# EAGLE design RY835AI_Stratux (EAGLE 8.2.1)
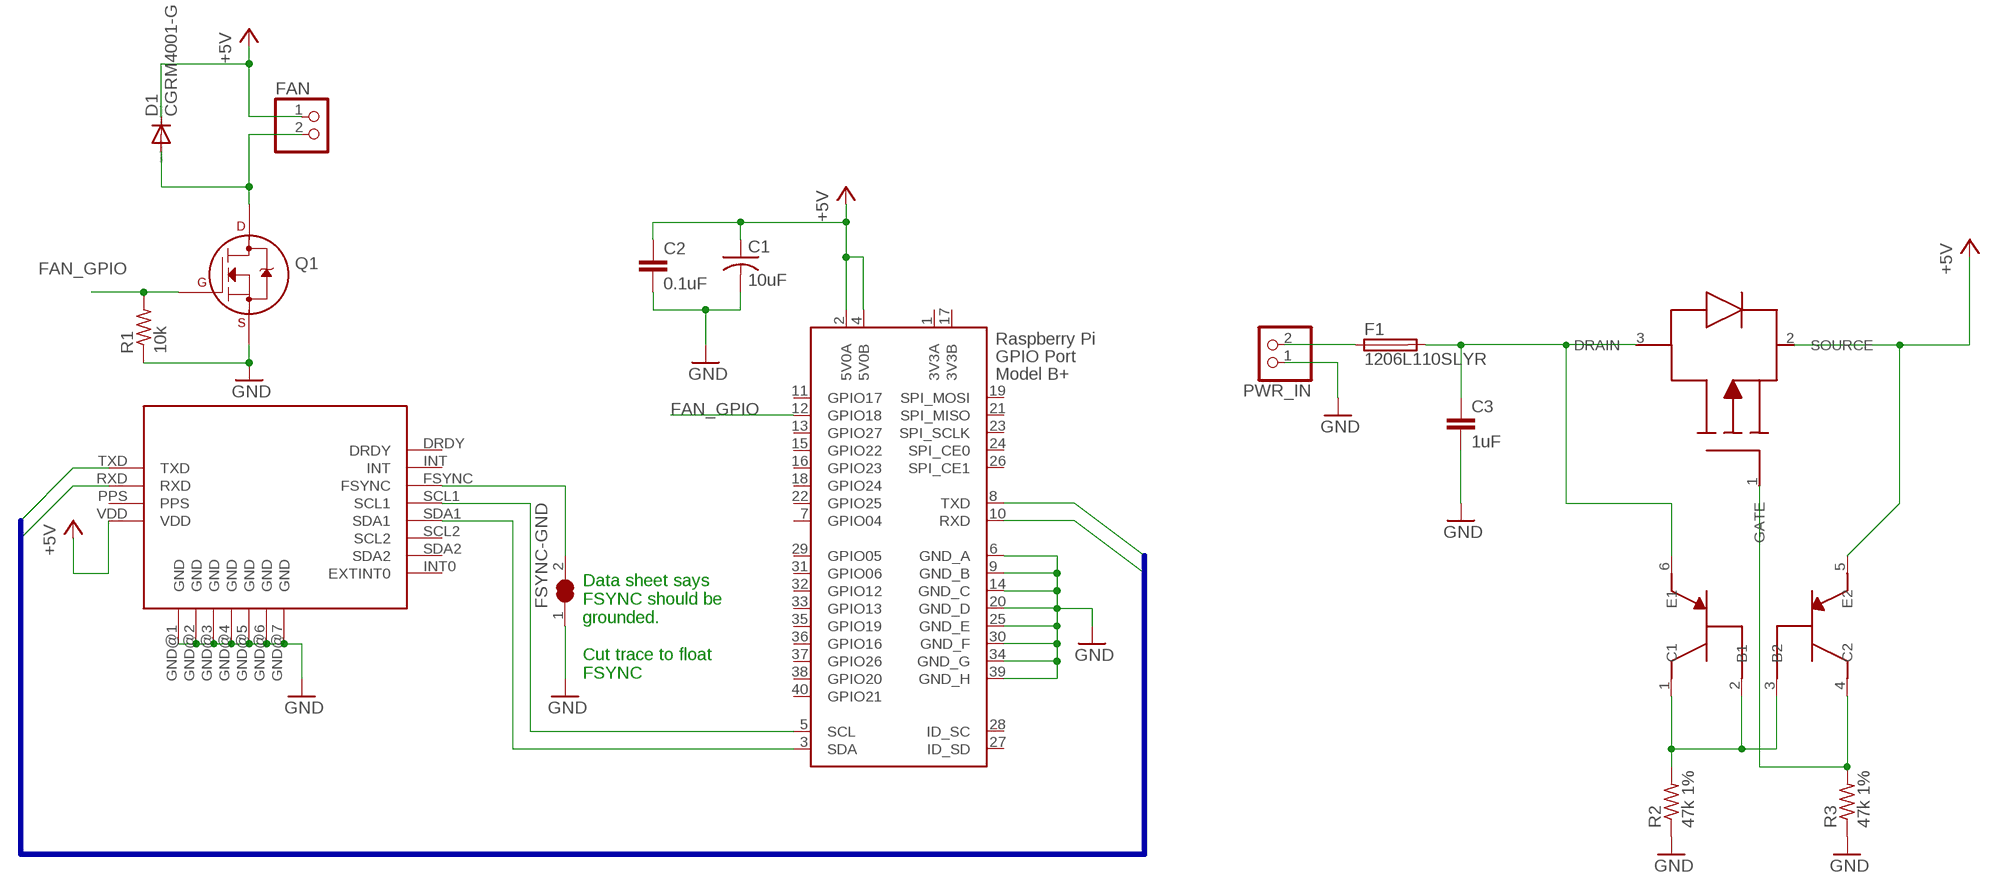
[diagram p0: schematic, sheet 1]

## Parts
C1  10uF  C-USC0805  [C0805]
C2  0.1uF  C-EUC0805  [C0805]
C3  1uF  C-EUC0805  [C0805]
D1  CGRM4001-G  [SOD-123_MINI-SMA]
F1  1206L110SLYR  FUSE  [R1206]
FAN  PINHD-1X2  [1X02]
FSYNC-GND  CUTJUMPER  [R1206-CUTJUMPER]
PWR_IN  PINHD-1X2  [1X02]
Q1  2N7000_SOT23  [SOT-23]
R1  10k  R-US_R0805  [R0805]
R2  47k 1%  R-US_R0805  [R0805]
R3  47k 1%  R-US_R0805  [R0805]
U$1  RY835AI  [RY835AI]
U$2  DMG2305UX  [SOT23]
U$3  DMMT5401  [SOT26]
X2  RASPI_BOARD_B+#_HD  [RASPI_BOARD_B+HAT_DF]

## Nets
+5V [5v]: C1.1 C2.1 D1.C FAN.1 U$1.VDD U$2.2(SOURCE) U$3.5(E2) X2.2(5V0A) X2.4(5V0B)
FAN_GPIO: Q1.1(G) R1.2 X2.12(GPIO18)
GND: C1.2 C2.2 C3.2 FSYNC-GND.1 PWR_IN.1 Q1.2(S) R1.1 R2.1 R3.1 U$1.GND@1(GND) U$1.GND@2(GND) U$1.GND@3(GND) U$1.GND@4(GND) U$1.GND@5(GND) U$1.GND@6(GND) U$1.GND@7(GND) X2.6(GND_A) X2.9(GND_B) X2.14(GND_C) X2.20(GND_D) X2.25(GND_E) X2.30(GND_F) X2.34(GND_G) X2.39(GND_H)
N$1: U$1.SDA1 X2.3(SDA)
N$2: U$1.SCL1 X2.5(SCL)
N$3: FSYNC-GND.2 U$1.FSYNC
N$4: D1.A FAN.2 Q1.3(D)
N$6: F1.1 PWR_IN.2
N$7: C3.1 F1.2 U$2.3(DRAIN) U$3.6(E1)
N$9: R2.2 U$3.1(C1) U$3.2(B1) U$3.3(B2)
N$10: R3.2 U$2.1(GATE) U$3.4(C2)
RXTX_BUS0: U$1.RXD X2.8(TXD)
RXTX_BUS1: U$1.TXD X2.10(RXD)
Unconnected: U$1.DRDY U$1.INT U$1.INT0(EXTINT0) U$1.PPS U$1.SCL2 U$1.SDA2 X2.7(GPIO04) X2.11(GPIO17) X2.13(GPIO27) X2.15(GPIO22) X2.16(GPIO23) X2.18(GPIO24) X2.19(SPI_MOSI) X2.21(SPI_MISO) X2.22(GPIO25) X2.23(SPI_SCLK) X2.24(SPI_CE0) X2.26(SPI_CE1) X2.27(ID_SD) X2.28(ID_SC) X2.29(GPIO05) X2.31(GPIO06) X2.32(GPIO12) X2.33(GPIO13) X2.35(GPIO19) X2.36(GPIO16) X2.37(GPIO26) X2.38(GPIO20) X2.40(GPIO21)

## Buses
RXTX_BUS[0..1]

## Notes on the sheet
- Data sheet says
  FSYNC should be
  grounded.
  
  Cut trace to float
  FSYNC

## Power pins joined to a net without a drawn wire
3V3A: X2.1(3V3A)
3V3B: X2.17(3V3B)

## Library data of the parts
C1 = rcl:C-US: CAPACITOR, American symbol
C2 C3 = rcl:C-EU: CAPACITOR, European symbol
D1 = diode:CGRM400*-G: Molded plasitc,JEDEC SOD-123/Mini SMA Source: Comchip CGRM4001-G.pdf
F1 = jblib:FUSE: Fuse
FAN PWR_IN = pinhead:PINHD-1X2: PIN HEADER
FSYNC-GND = jblib:CUTJUMPER: SMD solder JUMPER
Q1 = transistors:2N700*: 2N7000, 2N7002, NDS7002A N-channel enhancement mode MOSFET
R1-R3 = resistor:R-US_: RESISTOR, American symbol
U$1 = RY835AI:RY835AI: The REYAX RY835AI GNSS receiver module with embedded GPS/Glonass/BeiDou antenna enables high performance navigation in the most stringent applications and solid fix even in harsh GPS/Glonass/BeiDou visibility environments.
U$2 = jblib:DMG2305UX
U$3 = jblib:DMMT5401
X2 = raspberrypi_bastelstube_v13:RASPI_BOARD_B+#: Raspberry Pi GPIO connector with markings for the outer dimensions of the Raspberry Pi board model B+ with different sets of drill holes or mounting pads All pins connected

## Net classes
0 default: width 0.305 mm
1 5v: width 1.016 mm

## Board
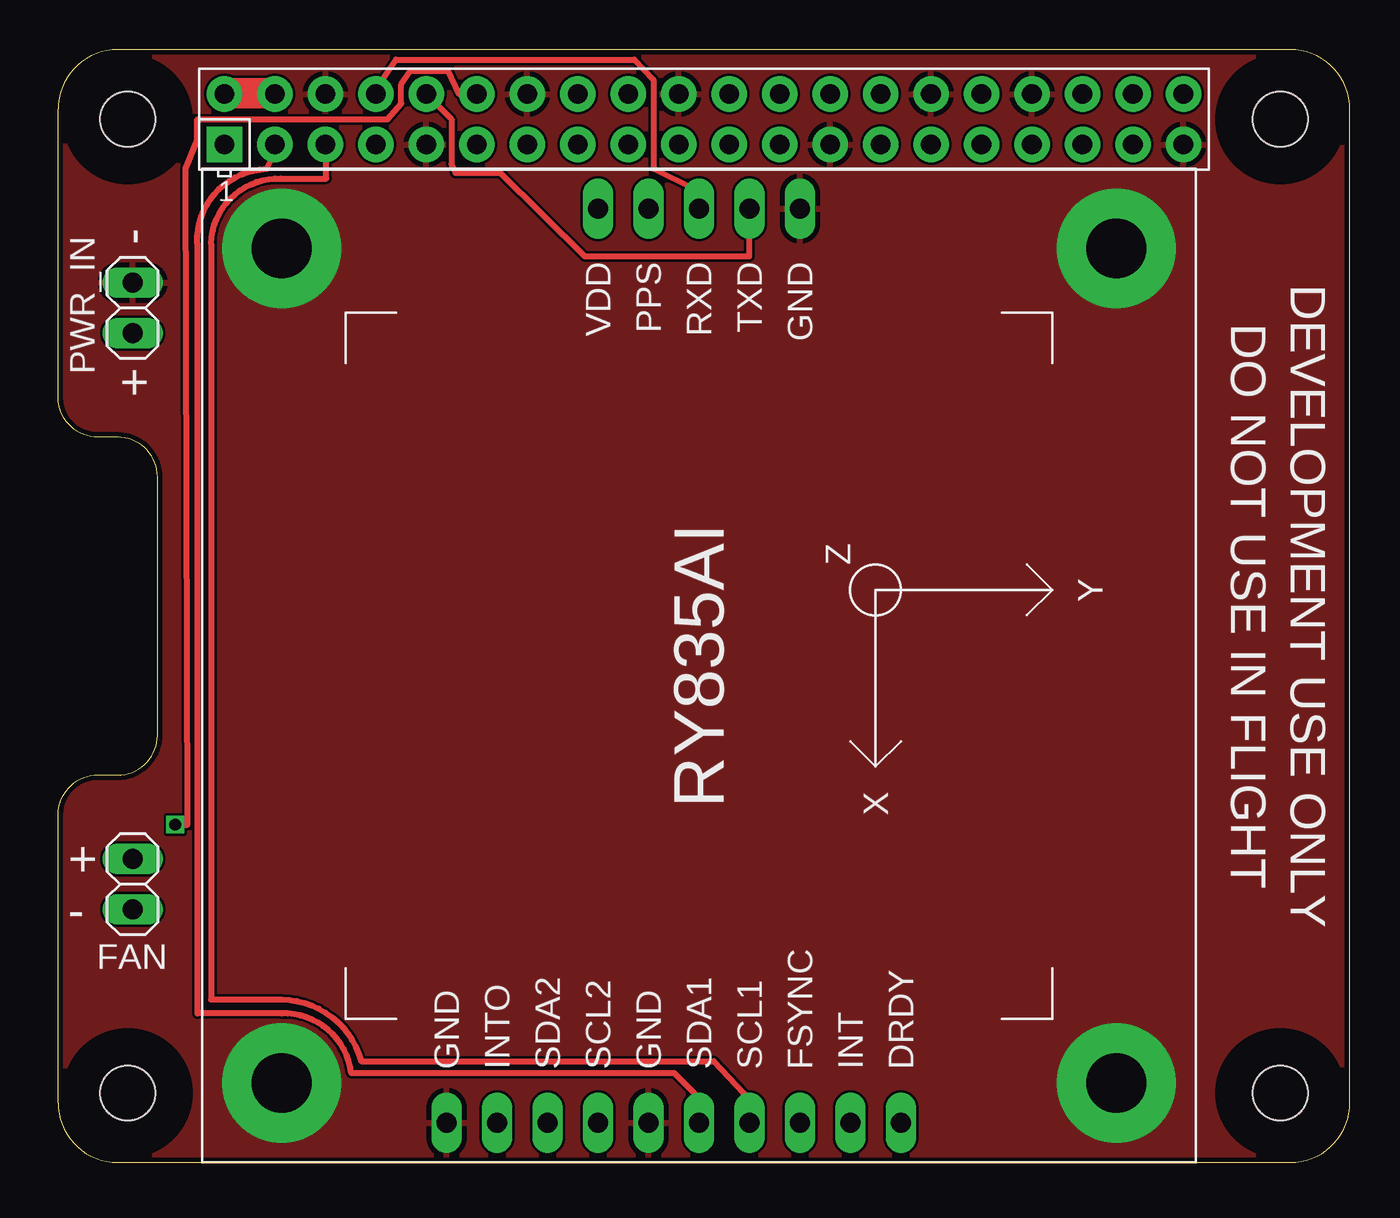
[diagram p1: board, top side]
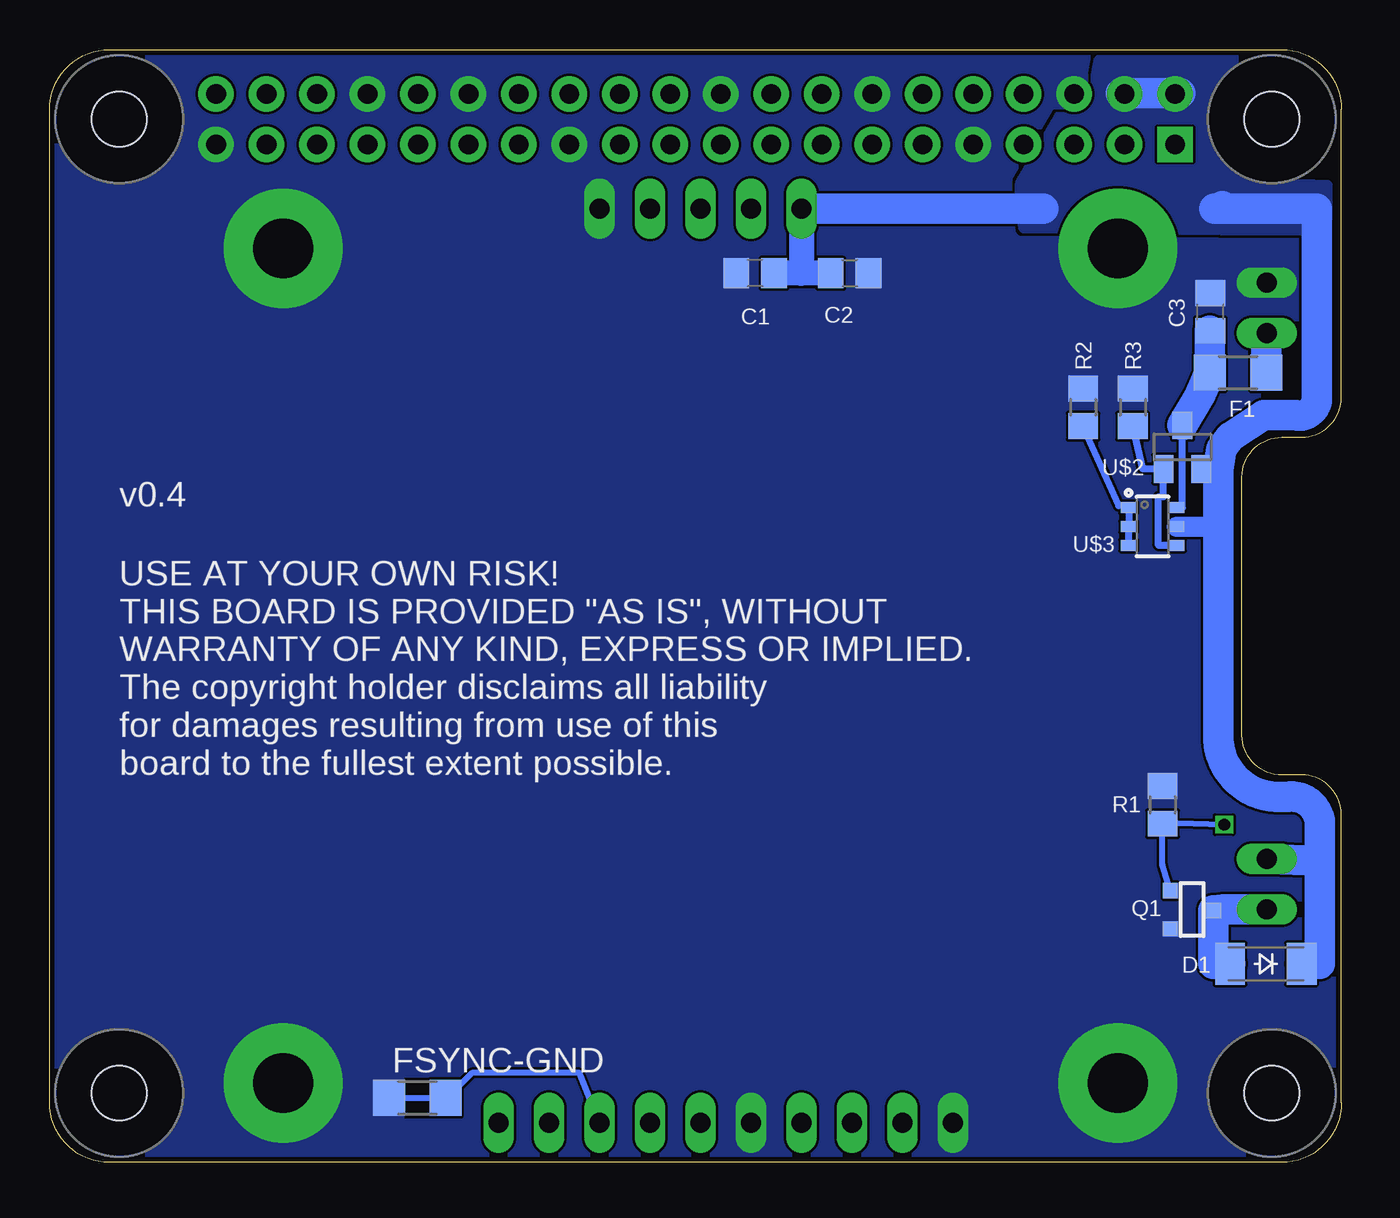
[diagram p2: board, bottom side, seen from below]

Size 65 x 56 mm. Coordinates in mm from the lower left corner, seen from the top.
Copper layers (1*16): Top 0.035mm / dielectric 1.5mm / Bottom 0.035mm
Design rules "dirt_cheap_dirty_boards.v1": minimum track width 5mil, minimum drill 12mil, track to track 5mil, track to pad 5mil, pad to pad 5mil, via to via 5mil, smd to smd 0mil, copper to edge 10mil, drill to drill 10mil, minimum pad ring 10mil, minimum via ring 6mil, stop-mask expansion 2mil, vias tented up to drill 25mil, thermal gap 10mil

### Footprints (pad centres in the part's own frame; a part is rotated, then mirrored left to right if it is on the bottom)
C0805 = smd 1.3 x 1.5: 1 -0.95,0; 2 0.95,0
SOD-123_MINI-SMA = smd 1.5 x 2.1: A 1.8,0; C -1.8,0
R1206 = smd 1.6 x 1.803: 1 -1.422,0; 2 1.422,0
1X02 = drill 1.016 long: 1 -1.27,0; 2 1.27,0
R1206-CUTJUMPER = smd 1.6 x 1.803: 1 -1.422,0; 2 1.422,0
SOT-23 = smd 0.762 x 0.762: 1 -0.979,-1.101; 2 0.94,-1.101; 3 0.025,1.067
R0805 = smd 1.3 x 1.5: 1 -0.95,0; 2 0.95,0
RY835AI = drill 1.016 long: DRDY 23,10.16; FSYNC 23,5.08; GND@1 -23,5.08; GND@2 23,-2.54; GND@3 23,-12.7; INT 23,7.62; INT0 23,-10.16; PPS -23,-2.54; RXD -23,0; SCL1 23,2.54; SCL2 23,-5.08; SDA1 23,0; SDA2 23,-7.62; TXD -23,2.54; VDD -23,-5.08 | drill 3 pad 6: GND@4 -21,21; GND@5 21,21; GND@6 -21,-21; GND@7 21,-21
SOT23 = smd 1 x 1.4: 1 -0.95,-1.1; 2 0.95,-1.1; 3 0,1.1
SOT26 = smd 0.55 x 0.8: 1 -0.95,-1.2; 2 0,-1.2; 3 0.95,-1.2; 4 0.95,1.2; 5 0,1.2; 6 -0.95,1.2
RASPI_BOARD_B+HAT_DF = drill 1 pad 1.778 square: 1 8.37,51.23 | drill 1 pad 1.778: 2 8.37,53.77; 3 10.91,51.23; 4 10.91,53.77; 5 13.45,51.23; 6 13.45,53.77; 7 15.99,51.23; 8 15.99,53.77; 9 18.53,51.23; 10 18.53,53.77; 11 21.07,51.23; 12 21.07,53.77; 13 23.61,51.23; 14 23.61,53.77; 15 26.15,51.23; 16 26.15,53.77; 17 28.69,51.23; 18 28.69,53.77; 19 31.23,51.23; 20 31.23,53.77; 21 33.77,51.23; 22 33.77,53.77; 23 36.31,51.23; 24 36.31,53.77; 25 38.85,51.23; 26 38.85,53.77; 27 41.39,51.23; 28 41.39,53.77; 29 43.93,51.23; 30 43.93,53.77; 31 46.47,51.23; 32 46.47,53.77; 33 49.01,51.23; 34 49.01,53.77; 35 51.55,51.23; 36 51.55,53.77; 37 54.09,51.23; 38 54.09,53.77; 39 56.63,51.23; 40 56.63,53.77 | hole 2.75: 3.5,3.5; 3.5,52.5; 61.5,3.5; 61.5,52.5

### Placement (x,y rotation side)
C1  29.5,44.75 180 bottom
C2  24.75,44.75 0 bottom
C3  6.6,42.8 90 bottom
D1  3.8,10 180 bottom
F1  5.2,39.75 180 bottom
FAN  3.75,14 270 top
FSYNC-GND  46.5,3.25 0 bottom
PWR_IN  3.75,43 270 top
Q1  7.5,12.7 270 bottom
R1  9,18 270 bottom
R2  13,38 270 bottom
R3  10.5,38 270 bottom
U$1  32.25,25 270 top
U$2  8,36 0 bottom
U$3  9.5,32 270 bottom
X2  0,0 0 top

### Tracks (layer width: path | path; a pad name or v marks a point on that pad's centre or on a via)
+5V
  Top 1.016: 8.6,53.8 X2.2 | 10.6,53.8 X2.4
  Top 1.524: 10.6,53.8 8.6,53.8
  Bottom 1.016: 6.4,48 6.4,48.1 | 6.2,34.9 U$2.2 | U$3.5 6.2,32
  Bottom 1.27: U$1.VDD 27.17,44.75 | C2.1 27.17,44.75 | 27.17,44.75 C1.1
  Bottom 1.524: 15,48 U$1.VDD | 6,48 1.25,48 1.25,38.3 arc90 2.3,37.6 3.9,37.6 5.6,36.5 6.05,35.9 6.2,34.9 6.2,32 6.2,21.3 arc-90 3,18.4 2.7,18.4 arc90 1.1,17.2 1.1,15.17 | 6,48 6.4,48 | 8.1,53.8 11.1,53.8 | 1.1,15.17 1.1,10 D1.C | FAN.1 1.1,15.17 | 6,48.12 6,48
  pour Bottom (rank 2, no thermals): 1.5,46.9 6,46.9 16,47 16.2,49.2 14.1,52.8 12.7,52.8 12.2,55.5 4.8,55.5 5.2,51.9 arc-90 3.2,49.3 0.7,49.2 0.7,47.5 arc90
FAN_GPIO  (via drill 0.6)
  Top 0.305: v5.9,17 6.5,17 6.4,50 7,51.5 7,52.5 16.58,52.5 17.26,53.29 17.26,54.25 17.75,54.94 19.61,54.94 20.18,53.77 X2.12
  Bottom 0.305: Q1.1 9,14.98 R1.2 9,17.1 v5.9,17
GND
  pour Bottom (rank 3, no thermals): 62,56 3,56 arc90 0,53 0,38.5 arc90 2,36.5 3,36.5 arc-90 5,34.5 5,21.5 arc-90 3,19.5 2,19.5 arc90 0,17.5 0,3 arc90 3,0 62,0 arc90 65,3 65,53 arc90
  pour Top: 62,56 3,56 arc90 0,53 0,38.5 arc90 2,36.5 3,36.5 arc-90 5,34.5 5,21.5 arc-90 3,19.5 2,19.5 arc90 0,17.5 0,3 arc90 3,0 62,0 arc90 65,3 65,53 arc90
N$1
  Top 0.305: U$1.SDA1 32,2 32,3.5 31,4.5 14.75,4.5 arc85 11.25,7.5 7,7.5 7,46.25 arc-90 10.5,50 11,51 X2.3
N$2
  Top 0.305: U$1.SCL1 34.5,2 34.5,3.5 33,5.1 15.25,5.1 arc74 11.25,8.2 7.7,8.2 7.7,46.25 arc-90 11.22,49.52 13.49,49.52 X2.5
N$3
  Bottom 0.305: U$1.FSYNC 38.33,4.5 43.75,4.5 45.08,3.17 FSYNC-GND.2
N$4
  Bottom 1.524: FAN.2 5.93,12.73 Q1.3 6.43,10 D1.A
N$6
  Bottom 0.356: PWR_IN.2 3.78,41.73
  Bottom 1.524: 3.78,41.73 F1.1
N$7
  Bottom 0.356: U$3.6 8,32.95 U$2.3 | F1.2 7,39.75 7,38 | C3.1 6.62,41.85
  Bottom 1.524: U$2.3 7.12,38.6 F1.2 6.62,41.85
N$9
  Bottom 0.356: U$3.3 U$3.2 U$3.1 11.2,33.05 R2.2
N$10
  Bottom 0.356: R3.2 10,34.9 U$2.1 8.95,33.5 9.2,33.5 9.2,31.05 U$3.4
RXTX_BUS0
  Top 0.305: U$1.RXD 32,48.25 32,49 29.95,50 29.95,54.5 29,55.5 17,55.5 16,54 X2.8
RXTX_BUS1
  Top 0.305: U$1.TXD 34.79,45.6 26.5,45.6 22.25,49.8 20,49.8 19.8,50.25 19.8,52.5 X2.10

### Text on the board
tNames: - | + | DO NOT USE IN FLIGHT | DEVELOPMENT USE ONLY | + | -
bNames: v0.4 | USE AT YOUR OWN RISK! / THIS BOARD IS PROVIDED "AS IS", WITHOUT / WARRANTY OF ANY KIND, EXPRESS OR IMPLIED. / The copyright holder disclaims all liability / for damages resulting from use of this / board to the fullest extent possible.